# EasyEDA Pro project VOTV_Drive.eprj

# Schematic Schematic1

## Sheets
1 StepperDriver: Board Name: Board1; Create Date: 2025-09-23; Page Name: StepperDriver; Project Name: VOTV_Drive; Schematic Name: Schematic1; Update Date: 2025-09-26; Company: EasyEDA.com; Page Size: A4; Version: V1.0
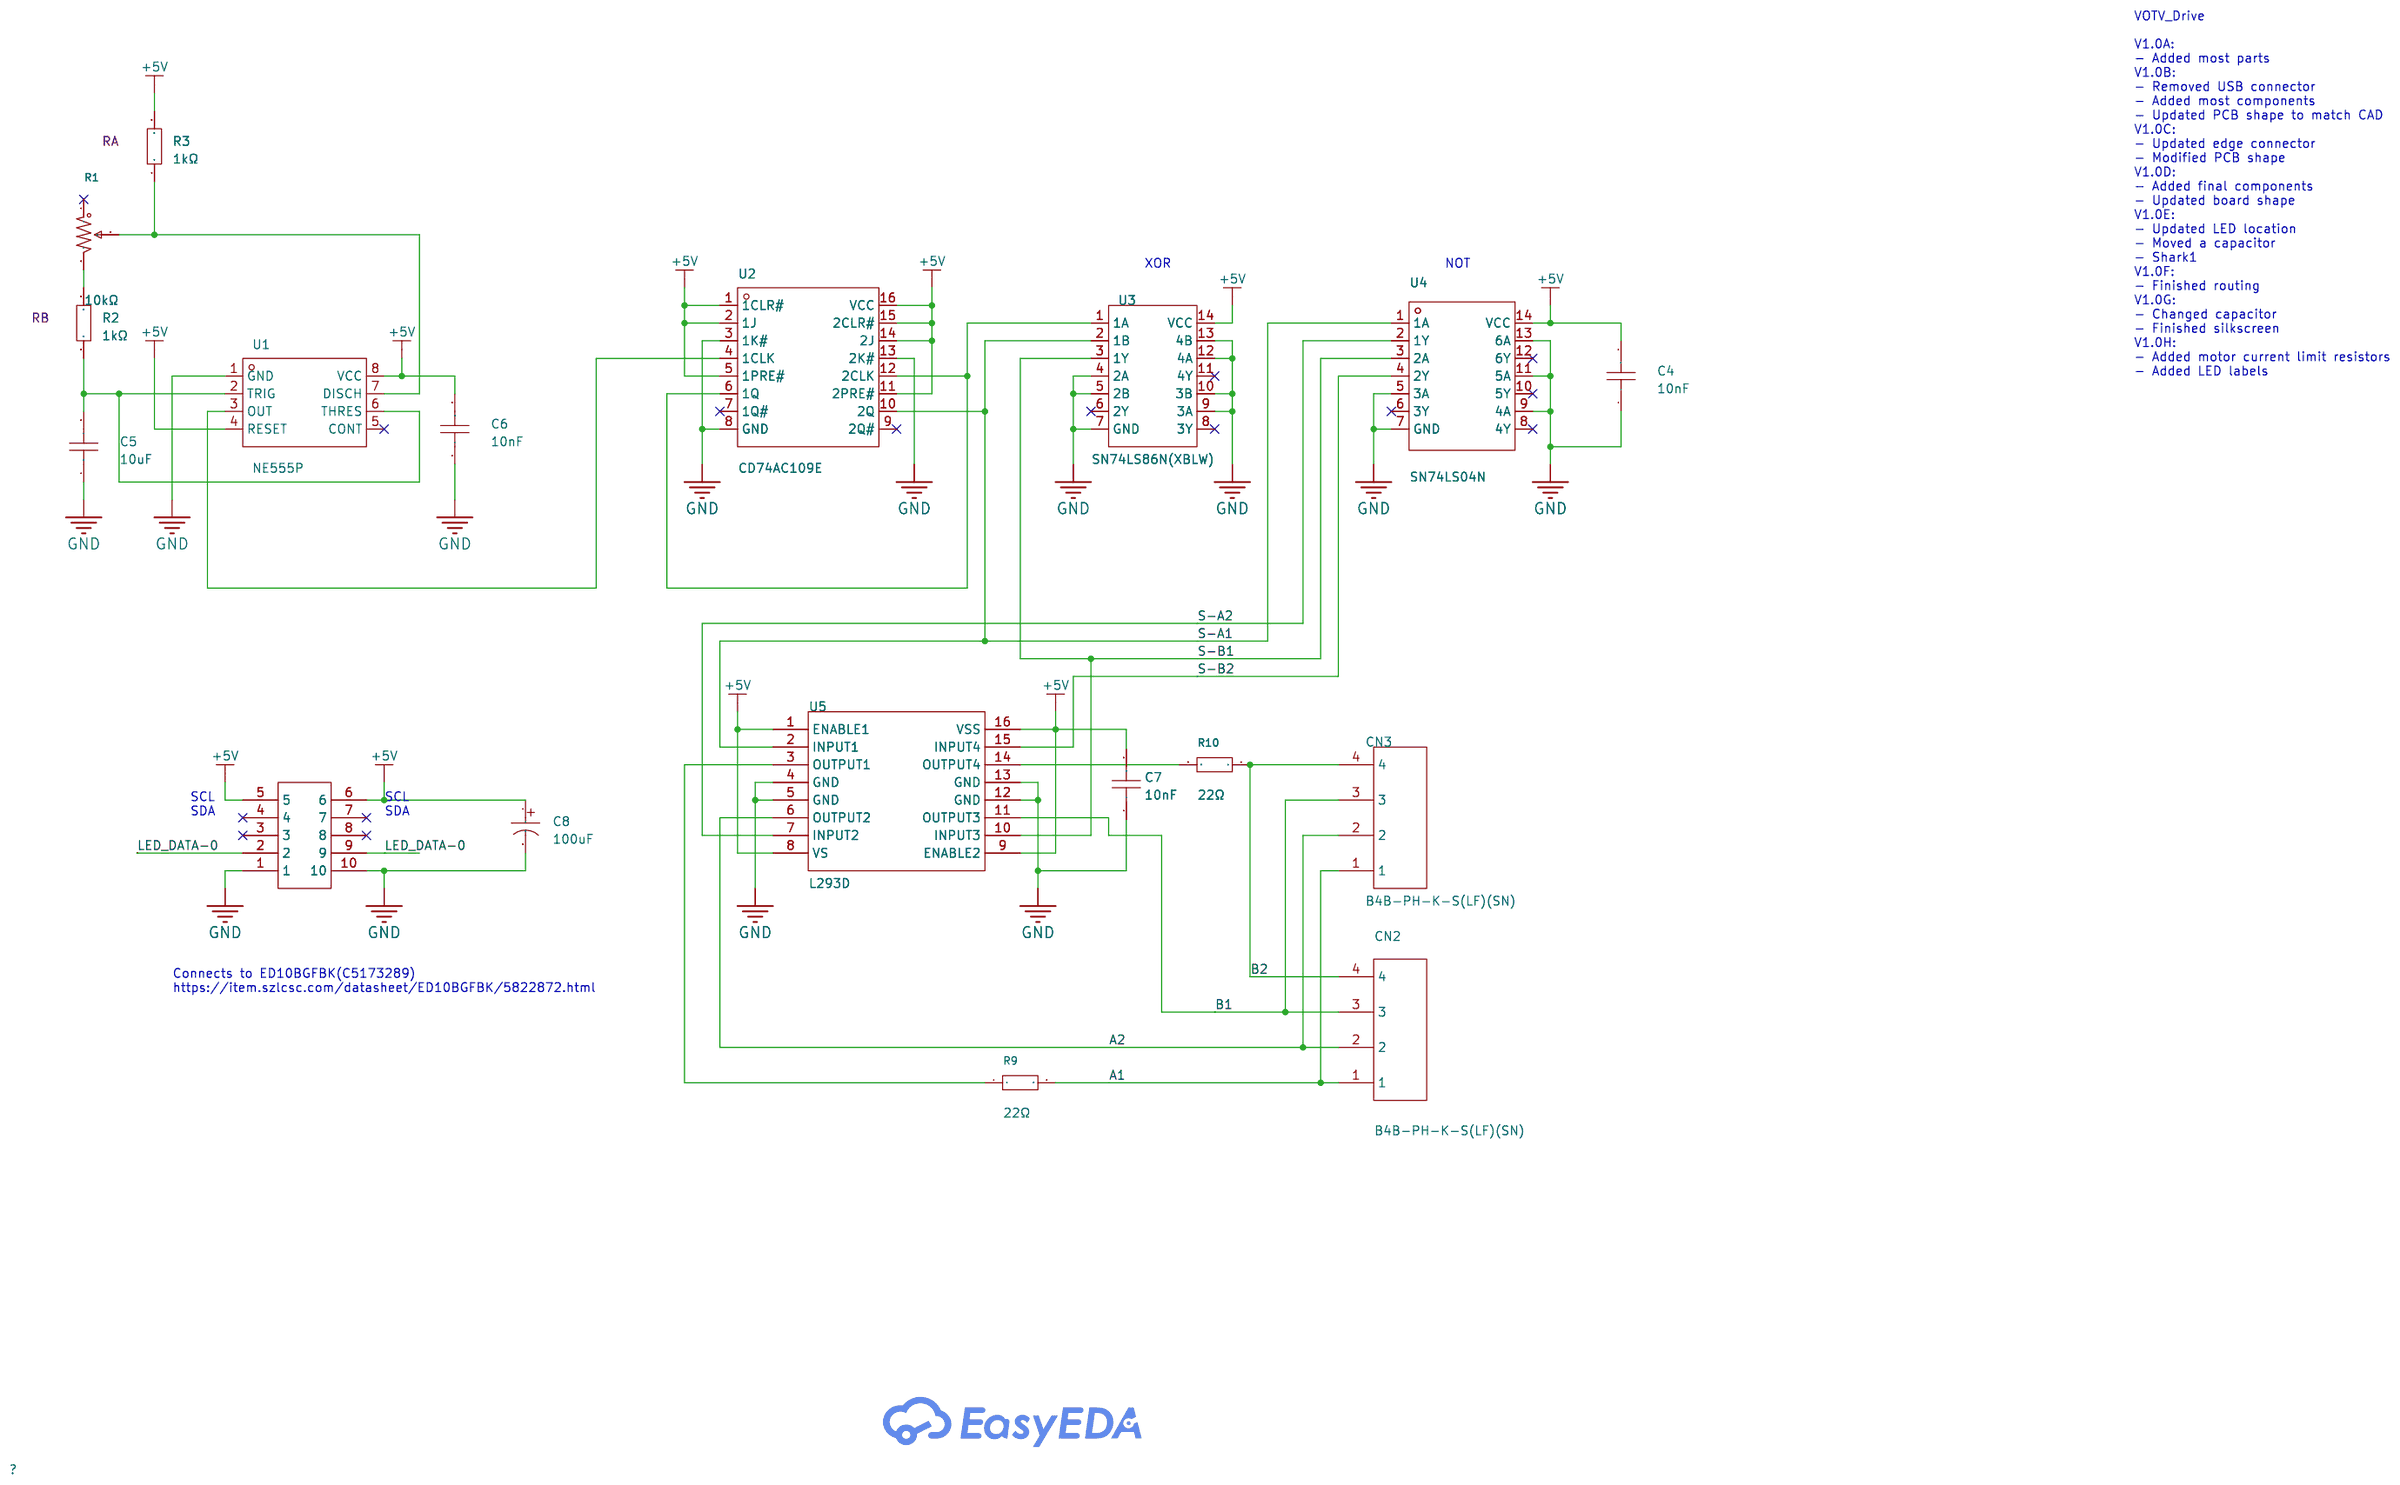
[diagram p0: StepperDriver]
2 Battery: Create Date: 2025-09-24; Page Name: Battery
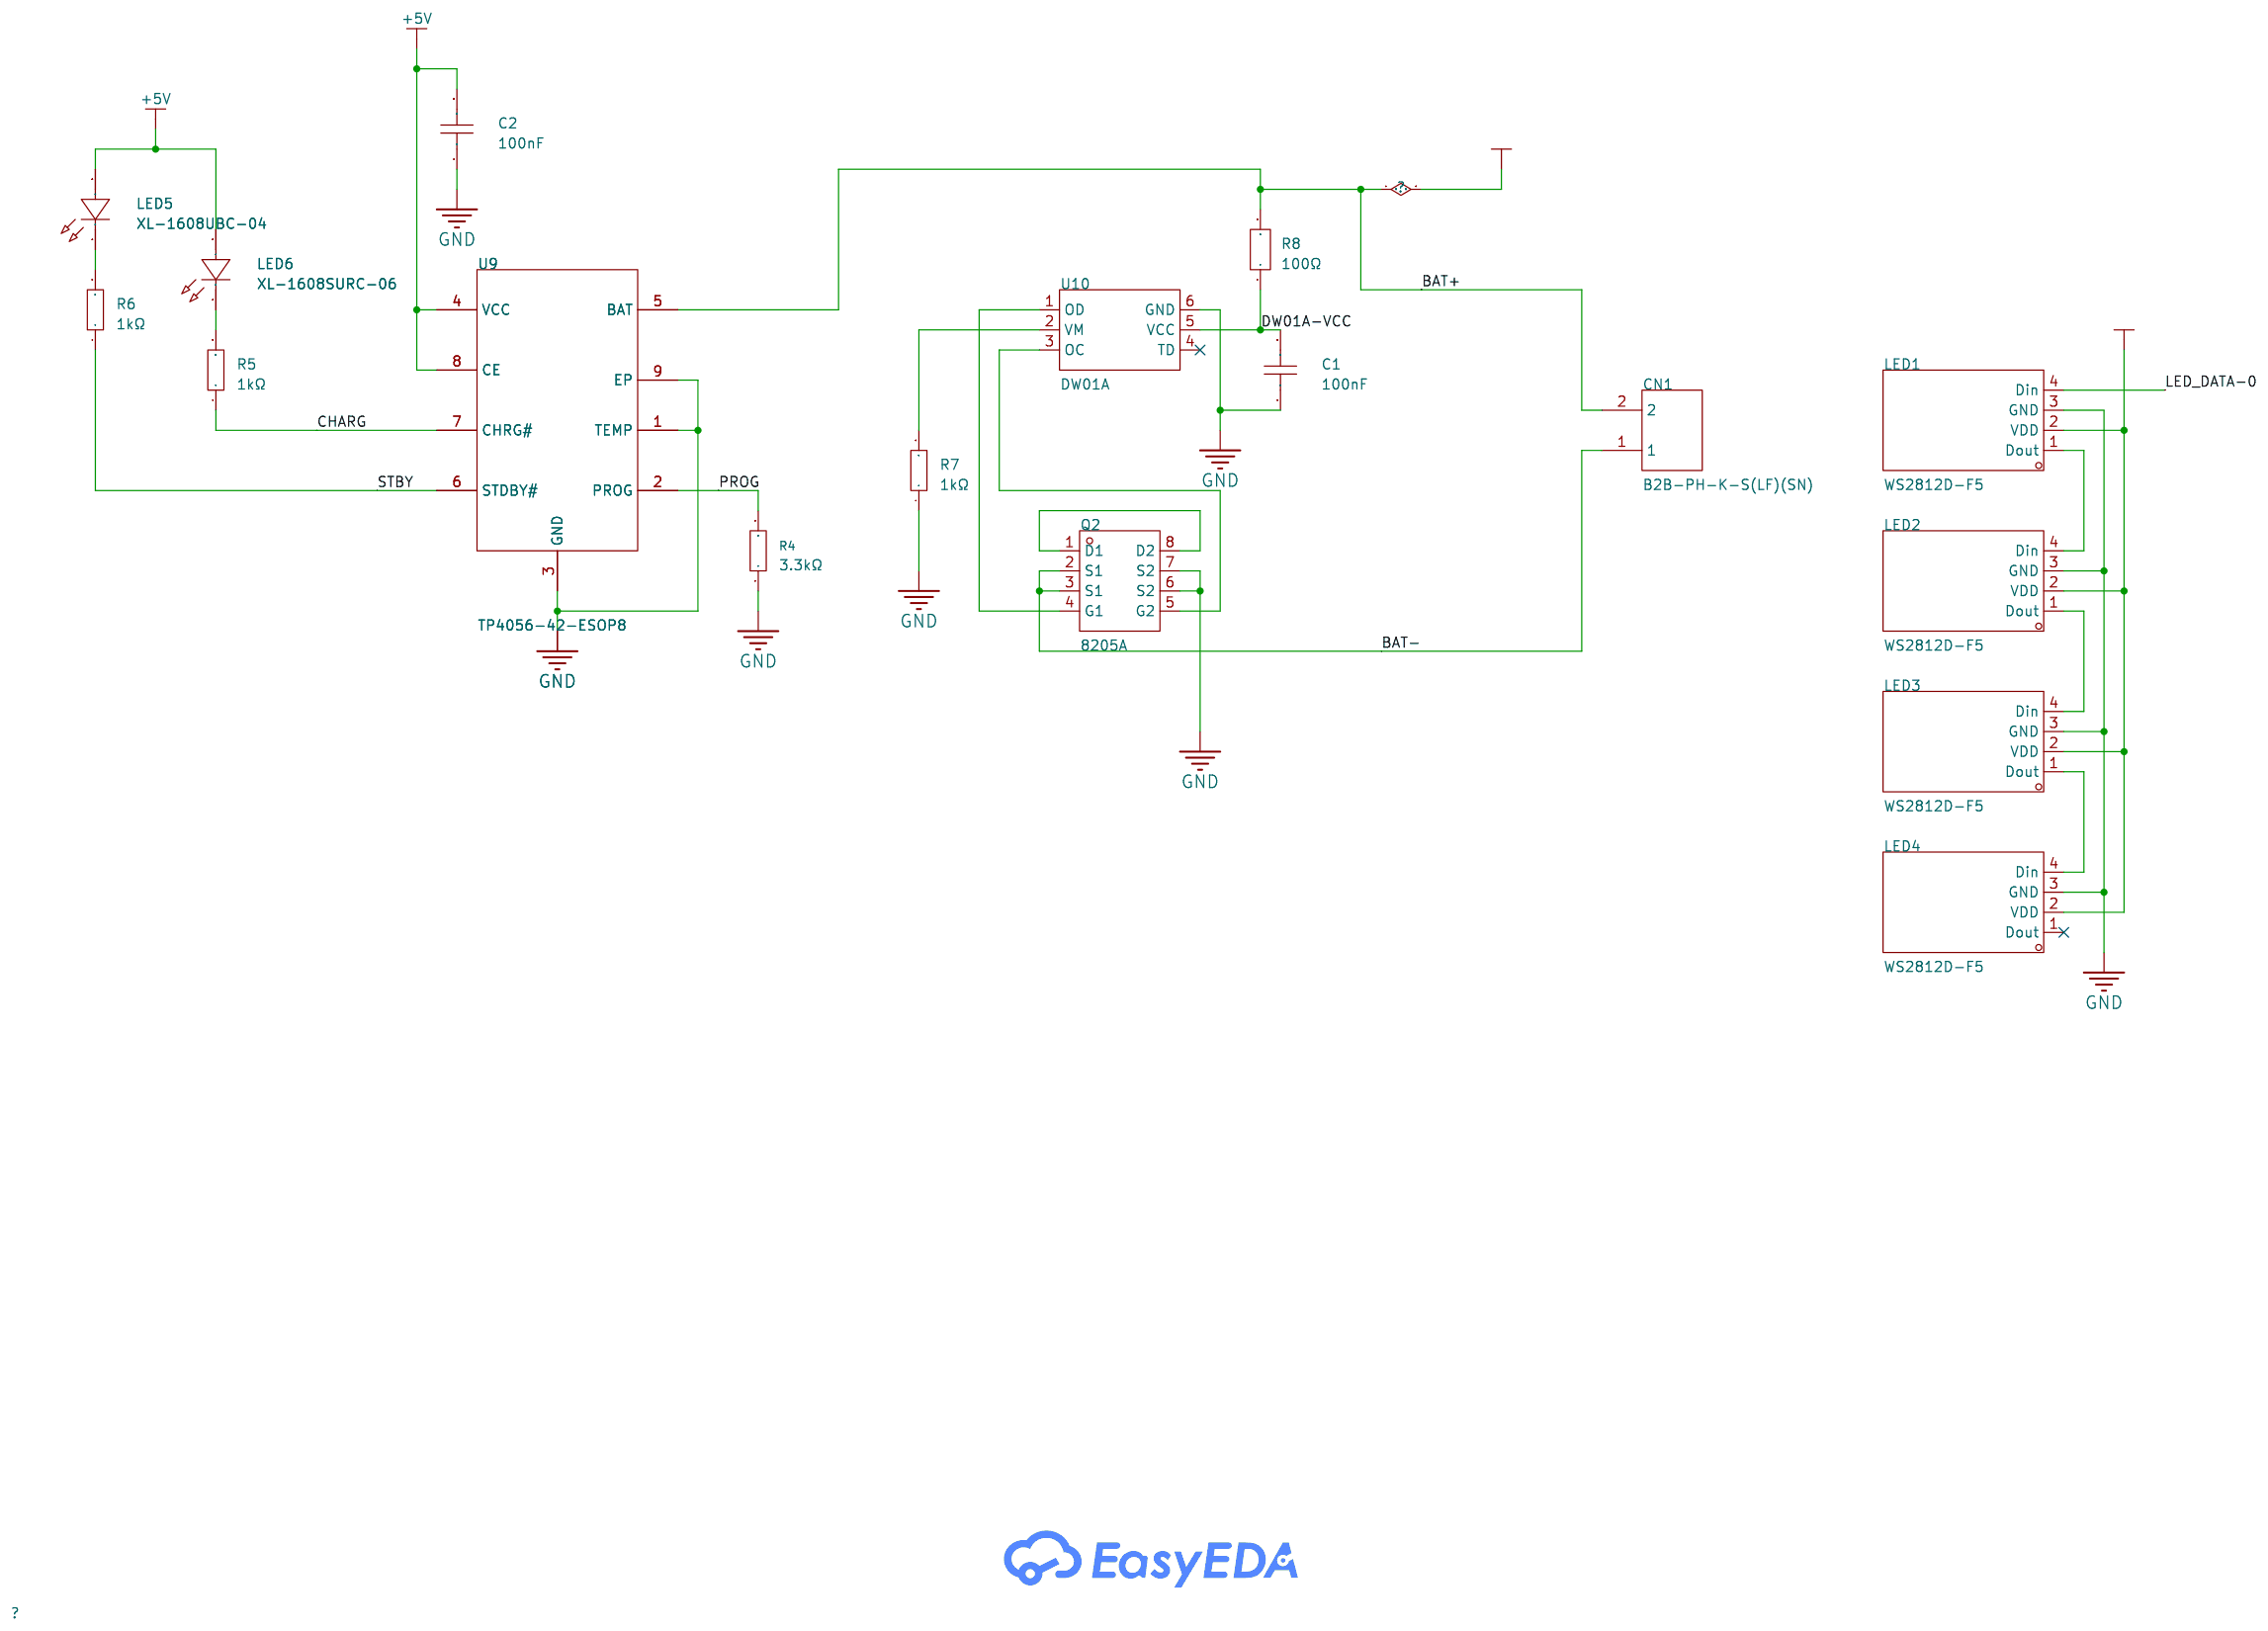
[diagram p1: Battery]

## Parts
sheet Battery
C1  100nF  [C0805]
C2  100nF  [C0805]
CN1  B2B-PH-K-S(LF)(SN)  [CONN-TH_B2B-PH-K-S]
LED1  WS2812D-F5  [LED-TH_4P-BD5.8-P1.30]
LED2  WS2812D-F5  [LED-TH_4P-BD5.8-P1.30]
LED3  WS2812D-F5  [LED-TH_4P-BD5.8-P1.30]
LED4  WS2812D-F5  [LED-TH_4P-BD5.8-P1.30]
LED5  XL-1608UBC-04  [LED0603-RD_BLUE]
LED6  XL-1608SURC-06  [LED0603-RD_RED]
Q2  8205A  [TSSOP-8_L4.4-W3.0-P0.65-LS6.4-BL]
R4  3.3kΩ  [R0603]
R5  1kΩ  [R0603]
R6  1kΩ  [R0603]
R7  1kΩ  [R0603]
R8  100Ω  [R0603]
U9  TP4056-42-ESOP8  [ESOP-8_L4.9-W3.9-P1.27-LS6.0-BL-EP]
U10  DW01A  [SOT-23-6_L2.9-W1.6-P0.95-LS2.8-BL]
sheet StepperDriver
C4  10nF  [CAP-TH_L5.5-W3.5-P5.00-D0.5]
C5  10uF  [CAP-TH_L5.5-W3.5-P5.00-D0.5]
C6  10nF  [CAP-TH_L5.5-W3.5-P5.00-D0.5]
C7  10nF  [CAP-TH_L5.5-W3.5-P5.00-D0.5]
C8  100uF  [CAP-TH_BD8.0-P3.50-D0.6-FD]
CN2  B4B-PH-K-S(LF)(SN)  [CONN-TH_B4B-PH-K-S]
CN3  B4B-PH-K-S(LF)(SN)  [CONN-TH_B4B-PH-K-S]
R1  10kΩ  [RES-ADJ-TH_WH06-2C-103]
R2  1kΩ  [RES-TH_BD1.8-L3.2-P7.20-D0.4]
R3  1kΩ  [RES-TH_BD1.8-L3.2-P7.20-D0.4]
R9  22Ω  [R0805]
R10  22Ω  [R0805]
U1  NE555P  [DIP-8_L9.8-W6.6-P2.54-LS7.6-BL]
U2  CD74AC109E  [PDIP-16_L19.1-W6.4-P2.54-LS7.62-BL]
U3  SN74LS86N(XBLW)  [DIP-14_L19.0-W6.4-P2.54-LS7.6-BL]
U4  SN74LS04N  [PDIP-14_L19.7-W6.6-P2.54-LS8.3-BL]
U5  L293D  [DIP-16_L20.0-W6.4-P2.54-LS7.6-BL]
U8  -  [EdgeConnector-10P-2.54mm	]

## Library data of the parts
C1 C2 = CC0805KRX7R9BB104: LCSC Part Name: 100nF ±10% 50V; Supplier Part: C49678; Manufacturer: YAGEO(国巨); Supplier Footprint: 0805; JLCPCB Part Class: Basic Part; Datasheet: https://item.szlcsc.com/datasheet/CC0805KRX7R9BB104/50686.html; Supplier: LCSC; Tolerance: ±10%; Voltage Rating: 50V; Temperature Coefficient: X7R
CN1 = B2B-PH-K-S(LF)(SN): LCSC Part Name: 1x2P 间距:2mm 直插 系列:PH; Supplier Part: C131337; Manufacturer: JST; Supplier Footprint: 插件,P=2mm; JLCPCB Part Class: Extended Part; Datasheet: https://atta.szlcsc.com/upload/public/pdf/source/20171026/C131342_15089839687311058815.pdf; Supplier: LCSC; Pins Structure: 1x2P; Pitch: 2mm; Mounting Type: Direct Insert; Reference Series: PH; Number of Pins: 2P; Number of Rows: 1; Number of PINs Per Row: 2; Current Rating: 2A; Contact Material: Brass; Contact Plating: Tin; Operating Temperature: -25℃~+85℃; Voltage Rating: 100V; Plastic Material: PA66; Flame Retardant Rating: UL94V-0; Supplementary Features: K-leg punch; Color: White; Z-Height of the Board: 6mm; X-Length of Bottom Edge on Board (Spacing Line): 5.9mm; Y-Width of Bottom Edge on Board: 4.5mm
LED1-LED4 = WS2812D-F5: LCSC Part Name: 智能控制通孔式LED集成光源; Supplier Part: C190565; Manufacturer: worldsemi; Supplier Footprint: 插件,D=5mm; JLCPCB Part Class: Extended Part; Datasheet: https://item.szlcsc.com/datasheet/WS2812D-F5/211094.html; Supplier: LCSC; Wavelength: R:620nm~625nm；B:465nm~470nm；G:520nm~525nm; Luminous Intensity: G:4000mcd；R:3000mcd；B:2500mcd; Fixed-Frequency Pwm Mode: 2kHz; Data Transmission Rate: 800Kbit/s; Voltage - Supply: 3.7V~5.3V; Operating Temperature: -25℃~+85℃; Peak Wavelength: G:522.5nm；R:622.5nm；B:467.5nm
LED5 = XL-1608UBC-04: LCSC Part Name: 0603蓝色贴片式发光二极管; Supplier Part: F; Manufacturer: XINGLIGHT(成兴光); Supplier Footprint: 0603; JLCPCB Part Class: Extended Part; Datasheet: https://item.szlcsc.com/datasheet/XL-1608UBC-04/1051416.html; Supplier: LCSC; Illumination Color: Blue; Voltage - Forward(Vf): 3.3V; Power(Watts): 70mW; Forward Current: 20mA; Wavelength - Dominant: 455nm~475nm; Peak Wavelength: 470nm; Lens Color: Water Clear; Luminous Intensity: 300mcd; Viewing Angle: 120°; Mounting Style: op View Mount
LED6 = XL-1608SURC-06: LCSC Part Name: 0603红色贴片式发光二极管; Supplier Part: C965799; Manufacturer: XINGLIGHT(成兴光); Supplier Footprint: 0603; JLCPCB Part Class: Extended Part; Datasheet: https://item.szlcsc.com/datasheet/XL-1608SURC-06/1051408.html; Supplier: LCSC; Illumination Color: Red; Voltage - Forward(Vf): 2.3V; Power(Watts): 50mW; Forward Current: 20mA; Wavelength - Dominant: 620nm~630nm; Peak Wavelength: 625nm; Lens Color: Water Clear; Luminous Intensity: 225mcd; Viewing Angle: 120°; Mounting Style: op View Mount; Operating Temperature: -40℃~+85℃
Q2 = 8205A_C5148694: LCSC Part Name: 双N沟道,电流:6A,耐压:20V; Supplier Part: C5148694; Manufacturer: HXY MOSFET(华轩阳电子); Supplier Footprint: TSSOP-8; JLCPCB Part Class: Extended Part; Datasheet: https://item.szlcsc.com/datasheet/8205A/5771942.html; Supplier: LCSC; Number: 2 N-Channel; Drain to Source Voltage: 20V; Current - Continuous Drain(Id): 6A; RDS(on): 37mΩ@2.5V,3.5A; Pd - Power Dissipation: 1.5W; Gate Threshold Voltage (Vgs(th)): 500mV; Gate Charge(Qg): 15nC@4.5V; Input Capacitance(Ciss): 600pF; Reverse Transfer Capacitance (Crss@Vds): 140pF; Operating Temperature: -55℃~+150℃
R4 = 0603WAF3301T5E: LCSC Part Name: 3.3kΩ ±1% 100mW 厚膜电阻; Supplier Part: C22978; Manufacturer: UNI-ROYAL(厚声); Supplier Footprint: 0603; JLCPCB Part Class: Basic Part; Datasheet: https://item.szlcsc.com/datasheet/0603WAF3301T5E/23705.html; Supplier: LCSC; Type: Thick Film Resistor; Tolerance: ±1%; Power(Watts): 100mW; Voltage-Supply(Max): 75V; Temperature Coefficient: ±100ppm/℃; Operating Temperature: -55℃~+155℃
R5-R7 = 0603WAF1001T5E: LCSC Part Name: 1kΩ ±1% 100mW 厚膜电阻; Supplier Part: C21190; Manufacturer: UNI-ROYAL(厚声); Supplier Footprint: 0603; JLCPCB Part Class: Basic Part; Datasheet: https://atta.szlcsc.com/upload/public/pdf/source/20200306/C422600_1E6D84923E4A46A82E41ADD87F860B5C.pdf; Supplier: LCSC; Type: Thick Film Resistors; Tolerance: ±1%; Temperature Coefficient: ±100ppm/℃; Operating Temperature Range: -55℃~+155℃
R8 = FRC0603J101 TS: LCSC Part Name: 100Ω ±5% 100mW 厚膜电阻; Supplier Part: C2907089; Manufacturer: FOJAN(富捷); Supplier Footprint: 0603; JLCPCB Part Class: Extended Part; Supplier: LCSC; Type: Thick Film Resistor; Tolerance: ±5%; Power(Watts): 100mW; Voltage-Supply(Max): 75V; Temperature Coefficient: ±100ppm/℃; Operating Temperature: -55℃~+155℃
U9 = TP4056-42-ESOP8: LCSC Part Name: 单节锂离子电池线性充电器; Supplier Part: C16581; Manufacturer: TOPPOWER(南京拓微); Supplier Footprint: ESOP-8; JLCPCB Part Class: Extended Part; Datasheet: https://item.szlcsc.com/datasheet/TP4056-42-ESOP8/17264.html; Supplier: LCSC; The Chip Type: Linear Charging IC; Voltage - Supply: 4V~8V; Charge Current - Max: 1A; Charging Saturation Voltage: 4.2V; Type of Battery: Lithium-ion/Polymer; Number of Cells: 1; Operating Temperature: -40℃~+85℃
U10 = DW01A_C351410: Supplier Part: C351410; Manufacturer: PUOLOP(迪浦); Supplier Footprint: SOT-23-6L; JLCPCB Part Class: Extended Part; Datasheet: https://atta.szlcsc.com/upload/public/pdf/source/20190109/C351410_3E9B9491D1909DF24C48D1B9CD871392.pdf; Supplier: LCSC
C4-C7 = FG26X7R1E106KRT06: LCSC Part Name: 10uF ±10% 25V; Supplier Part: C531341; Manufacturer: TDK; Supplier Footprint: 插件,P=5mm; JLCPCB Part Class: Extended Part; Datasheet: https://item.szlcsc.com/datasheet/FG26X7R1E106KRT06/551502.html; Supplier: LCSC; Tolerance: ±10%; Voltage Rating: 25V; Temperature Coefficient: X7R
C8 = KM107M050F12RR0VH2FP0: LCSC Part Name: 100uF ±20% 50V; Supplier Part: C2749; Manufacturer: Chengx(承兴); Supplier Footprint: 插件,D8xL12mm; JLCPCB Part Class: Extended Part; Datasheet: https://item.szlcsc.com/datasheet/KM107M050F12RR0VH2FP0/3130.html; Supplier: LCSC; Tolerance: ±20%; Voltage Rating: 50V; Pin Spacing: 3.5mm; Diameter: 8mm; Height - Seated (Max): 12mm; Lifetime: 2000hrs@105℃
CN2 CN3 = B4B-PH-K-S(LF)(SN)_C131334: LCSC Part Name: 1x4P 间距:2mm 直插 系列:PH; Supplier Part: C131334; Manufacturer: JST; Supplier Footprint: 插件,P=2mm; JLCPCB Part Class: Extended Part; Datasheet: https://item.szlcsc.com/datasheet/B4B-PH-K-S(LF)(SN)/142627.html; Supplier: LCSC; Pins Structure: 1x4P; Pitch: 2mm; Mounting Type: Through Hole; Reference Series: PH; Number of Pins: 4P; Number of Rows: 1; Number of PINs Per Row: 4; Current Rating: 2A; Contact Material: Brass; Contact Plating: Tin; Operating Temperature: -25℃~+85℃; Voltage Rating: 100V; Plastic Material: PA66; Flame Retardant Rating: UL94V-0; Supplementary Features: K Pin; Color: White; Z-Height of the Board: 6mm; X-Length of Bottom Edge on Board (Spacing Line): 9.9mm; Y-Width of Bottom Edge on Board: 4.5mm
R1 = WH06-2C-103(10K): LCSC Part Name: 10kΩ ±25%; Supplier Part: C5205043; Manufacturer: BOCHEN(博晨); Supplier Footprint: 插件; JLCPCB Part Class: Extended Part; Datasheet: https://atta.szlcsc.com/upload/public/pdf/source/20221019/683A1EE763180882FA5E0C1228474CEE.pdf; Supplier: LCSC; Tolerance: ±25%
R2 = Res_AXIAL-1/8W: Supplier Footprint: Through; Comment: RB
R3 = Res_AXIAL-1/8W: Supplier Footprint: Through; Comment: RA
R9 R10 = 0805W8F220JT5E: LCSC Part Name: 22Ω ±1% 125mW 厚膜电阻; Supplier Part: C17561; Manufacturer: UNI-ROYAL(厚声); Supplier Footprint: 0805; JLCPCB Part Class: Basic Part; Datasheet: https://item.szlcsc.com/datasheet/0805W8F220JT5E/18249.html; Supplier: LCSC; Type: Thick Film Resistor; Tolerance: ±1%; Power(Watts): 125mW; Voltage-Supply(Max): 150V; Temperature Coefficient: ±100ppm/℃; Operating Temperature: -55℃~+155℃
U1 = NE555P: Supplier Part: C46749; Manufacturer: TI(德州仪器); Supplier Footprint: DIP-8; JLCPCB Part Class: Extended Part; Datasheet: https://www.ti.com/cn/lit/gpn/ne555; Supplier: LCSC
U2 = CD74AC109E: Supplier Part: C1549858; Manufacturer: TI(德州仪器); Supplier Footprint: PDIP-16; JLCPCB Part Class: Extended Part; Datasheet: https://www.ti.com/cn/lit/gpn/cd54ac109; Supplier: LCSC; Type: JK-Type; Trigger Type: Rising Edge; Voltage - Supply: 1.5V~5.5V; Clock Frequency: 100MHz; Function: Set and Reset; Number of Elements: 2; Number of Bits per Element: 1; Output Type: Complementary Type; Propagation Delay: 10.3ns@5V,50pF; Series: 74ACSeries; Current - Output Low(IOL): 24mA; Current - Output High(IOH): 24mA; Quiescent Current: 4uA; Input Capacitance: 10pF; Operating Temperature: -55℃~+125℃
U3 = SN74LS86N(XBLW): Supplier Part: C42415784; Manufacturer: XBLW(芯伯乐); Supplier Footprint: DIP-14; JLCPCB Part Class: Extended Part; Datasheet: https://item.szlcsc.com/datasheet/SN74LS86N(XBLW)/44412904.html; Supplier: LCSC; Logic Type: XOR Gate; Number of Channels: 4; Voltage - Supply: 2V~6V; Quiescent Current: 2uA; Current - Output Low(IOL): 5.2mA; Current - Output High(IOH): 5.2mA; Input Logic Level - High: 1.2V~3.2V; Input Logic Level - Low: 800mV~2.8V; Output Logic Level - High: 2V~5.81V
U4 = SN74LS04N: Supplier Part: C183657; Manufacturer: TI(德州仪器); Supplier Footprint: PDIP-14; JLCPCB Part Class: Extended Part; Datasheet: https://www.ti.com/cn/lit/gpn/sn74ls04; Supplier: LCSC; Voltage - Supply: 4.75V~5.25V; Number of Circuits: 6; Number of Inputs: 1; Current - Output Low(IOL): 8mA; Current - Output High(IOH): 400uA; Input Logic Level - High: 2V; Input Logic Level -Low: 800mV; Max Propagation Delay: 15ns@5V,15pF; Series: 74LSSeries; Operating Temperature: 0℃~+70℃
U5 = L293D_C12340: LCSC Part Name: 600mA 有刷直流电机驱动芯片 36V; Supplier Part: C12340; Manufacturer: ST(意法半导体); Supplier Footprint: DIP-16; JLCPCB Part Class: Extended Part; Datasheet: https://atta.szlcsc.com/upload/public/pdf/source/20140724/1457707157802.pdf; Supplier: LCSC
U8 = EdgeConnector-10P-2.54mm

## Nets
+5V: C2.2 C4.2 C6.2 C7.2 C8.1 LED5.2(A) LED6.2(A) R3.2 U1.4(RESET) U1.8(VCC) U2.1(1CLR#) U2.2(1J) U2.5(1PRE#) U2.11(2PRE#) U2.14(2J) U2.15(2CLR#) U2.16(VCC) U3.14(VCC) U4.14(VCC) U5.1(ENABLE1) U5.8(VS) U5.9(ENABLE2) U5.16(VSS) U8.5 U8.6 U9.4(VCC) U9.8(CE)
GND: C1.1 C2.1 C4.1 C5.1 C6.1 C7.1 C8.2 LED1.3(GND) LED2.3(GND) LED3.3(GND) LED4.3(GND) Q2.6(S2) Q2.7(S2) R4.1 R7.1 U1.1(GND) U2.3(1K#) U2.8(GND) U2.13(2K#) U3.4(2A) U3.5(2B) U3.7(GND) U3.9(3A) U3.10(3B) U3.12(4A) U3.13(4B) U4.5(3A) U4.7(GND) U4.9(4A) U4.11(5A) U4.13(6A) U5.4(GND) U5.5(GND) U5.12(GND) U5.13(GND) U8.1 U8.10 U9.1(TEMP) U9.3(GND) U9.9(EP) U10.6(GND)
A1: CN2.1 CN3.1 R9.2
A2: CN2.2 CN3.2 U5.6(OUTPUT2)
B1: CN2.3 CN3.3 U5.11(OUTPUT3)
B2: CN2.4 CN3.4 R10.1
BAT-: CN1.1 Q2.2(S1) Q2.3(S1)
BAT_VOUT: CN1.2 LED1.2(VDD) LED2.2(VDD) LED3.2(VDD) LED4.2(VDD) R8.2 U9.5(BAT)
CHARG: R5.1 U9.7(CHRG#)
DW01A-VCC: C1.2 R8.1 U10.5(VCC)
LED_DATA-0: LED1.4(Din) U8.2 U8.9
PROG: R4.2 U9.2(PROG)
S-A1: U2.10(2Q) U3.2(1B) U4.1(1A) U5.2(INPUT1)
S-A2: U4.2(1Y) U5.7(INPUT2)
S-B1: U3.3(1Y) U4.3(2A) U5.10(INPUT3)
S-B2: U4.4(2Y) U5.15(INPUT4)
STBY: R6.1 U9.6(STDBY#)
$1N1551: C5.2 R2.1 U1.2(TRIG) U1.6(THRES)
$1N1658: R1.3 R3.1 U1.7(DISCH)
$1N1662: R1.2 R2.2
$1N1856: U1.3(OUT) U2.4(1CLK)
$1N1934: U2.6(1Q) U2.12(2CLK) U3.1(1A)
$1N10913: R9.1 U5.3(OUTPUT1)
$1N11045: R10.2 U5.14(OUTPUT4)
$2N372: Q2.5(G2) U10.3(OC)
$2N386: R7.2 U10.2(VM)
$2N1182: LED1.1(Dout) LED2.4(Din)
$2N1186: LED2.1(Dout) LED3.4(Din)
$2N1199: LED3.1(Dout) LED4.4(Din)
$2N2605: LED5.1(K) R6.2
$2N2609: LED6.1(K) R5.2
$2N3306: Q2.1(D1) Q2.8(D2)
$2N3476: Q2.4(G1) U10.1(OD)

Not connected (* = marked no-connect by the designer): LED4 1(Dout)*; R1 1*; U1 5(CONT)*; U2 7(1Q#)* 9(2Q#)*; U3 6(2Y)* 8(3Y)* 11(4Y)*; U4 6(3Y)* 8(4Y)* 10(5Y)* 12(6Y)*; U8 3* 4* 7* 8*; U10 4(TD)*

## Notes on the sheets
sheet 1
- VOTV_Drive
- V1.0A:
  - Added most parts
  V1.0B:
  - Removed USB connector
  - Added most components
  - Updated PCB shape to match CAD
  V1.0C:
  - Updated edge connector
  - Modified PCB shape
  V1.0D:
  - Added final components
  - Updated board shape
  V1.0E:
  - Updated LED location
  - Moved a capacitor
  - Shark1
  V1.0F:
  - Finished routing
  V1.0G:
  - Changed capacitor
  - Finished silkscreen
  V1.0H:
  - Added motor current limit resistors
  - Added LED labels
- XOR
- NOT
- SCL
  SDA
- SCL
  SDA
- Connects to ED10BGFBK(C5173289)
  https://item.szlcsc.com/datasheet/ED10BGFBK/5822872.html

# Board PCB1
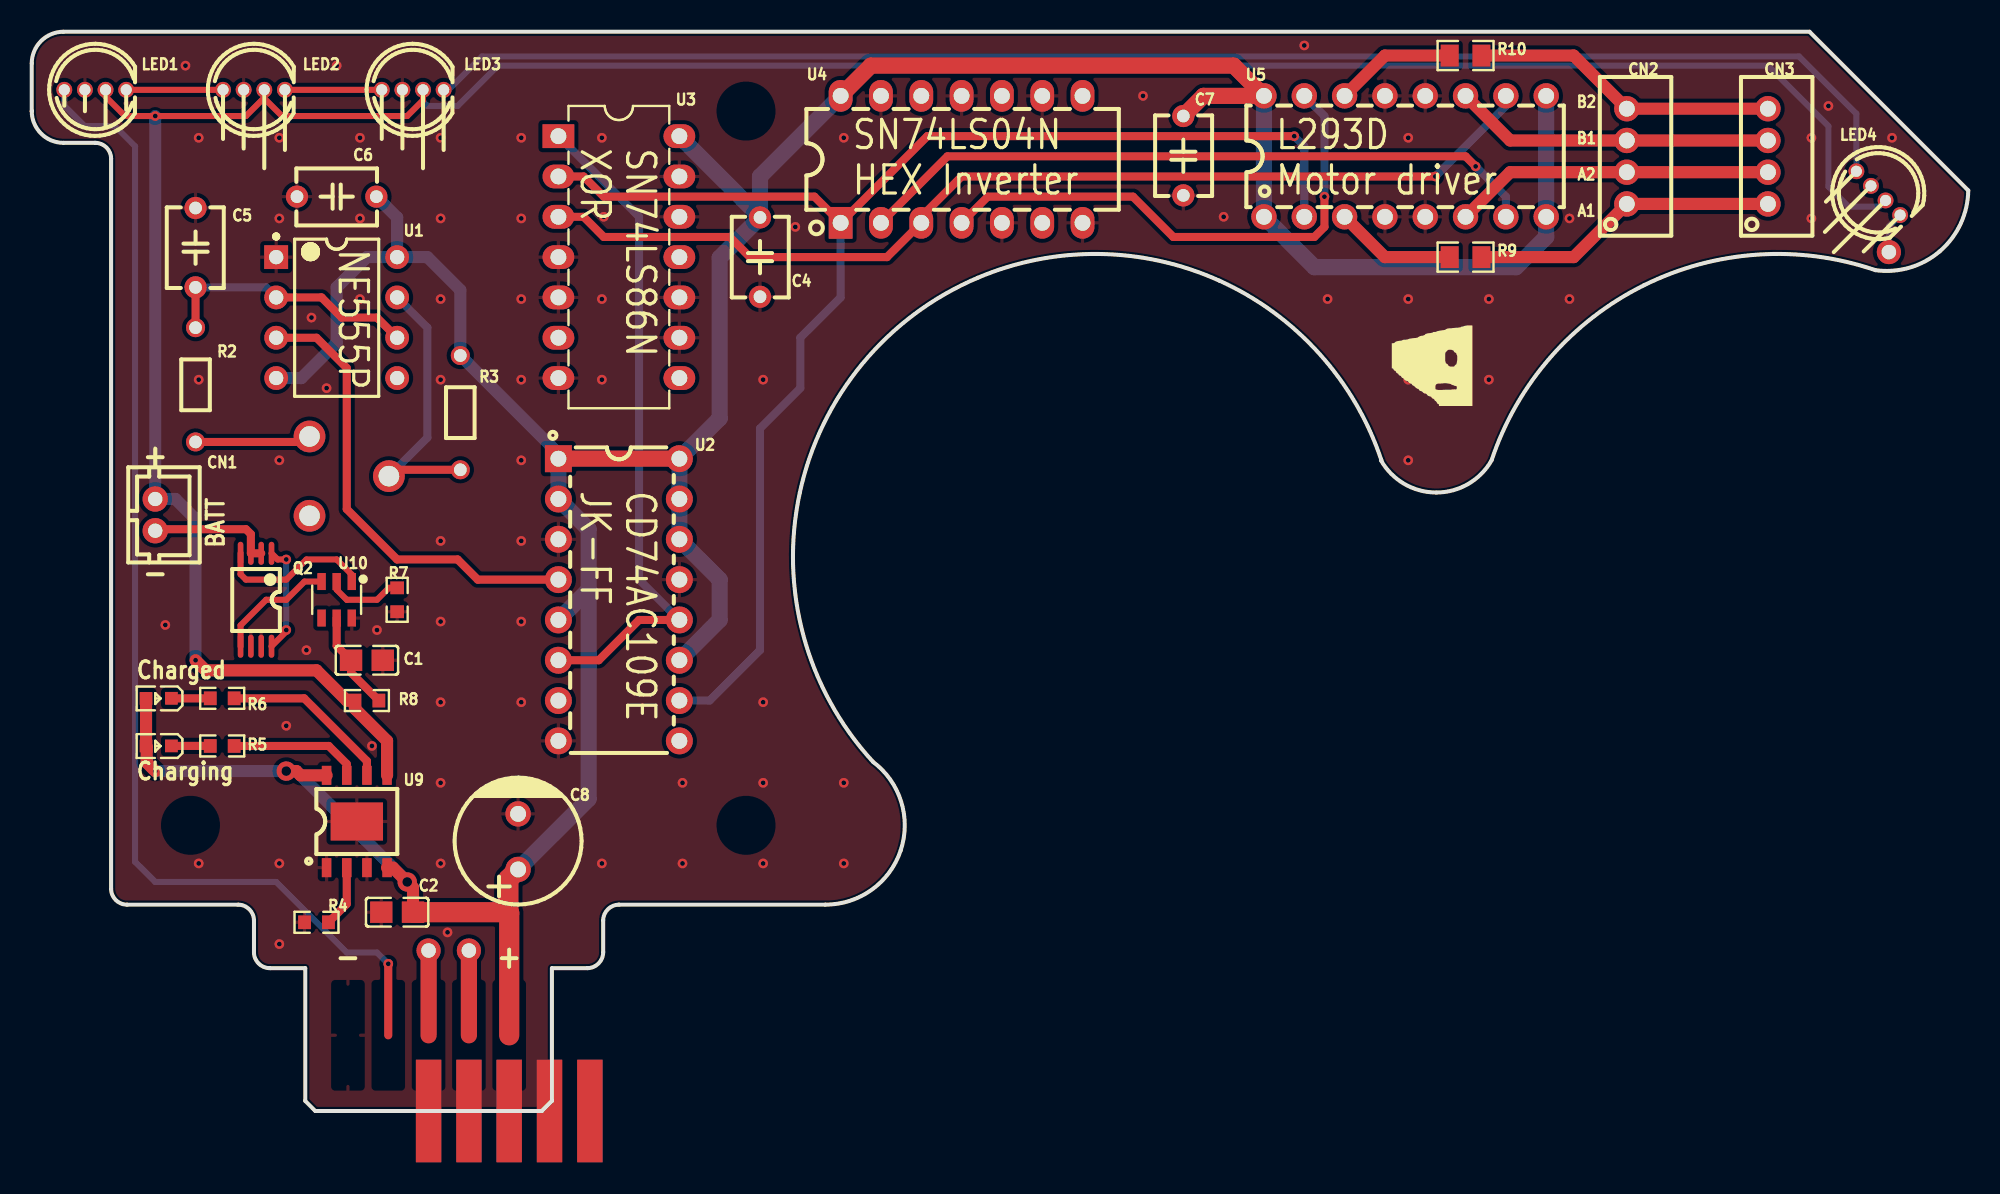
[diagram p2: board, top side]
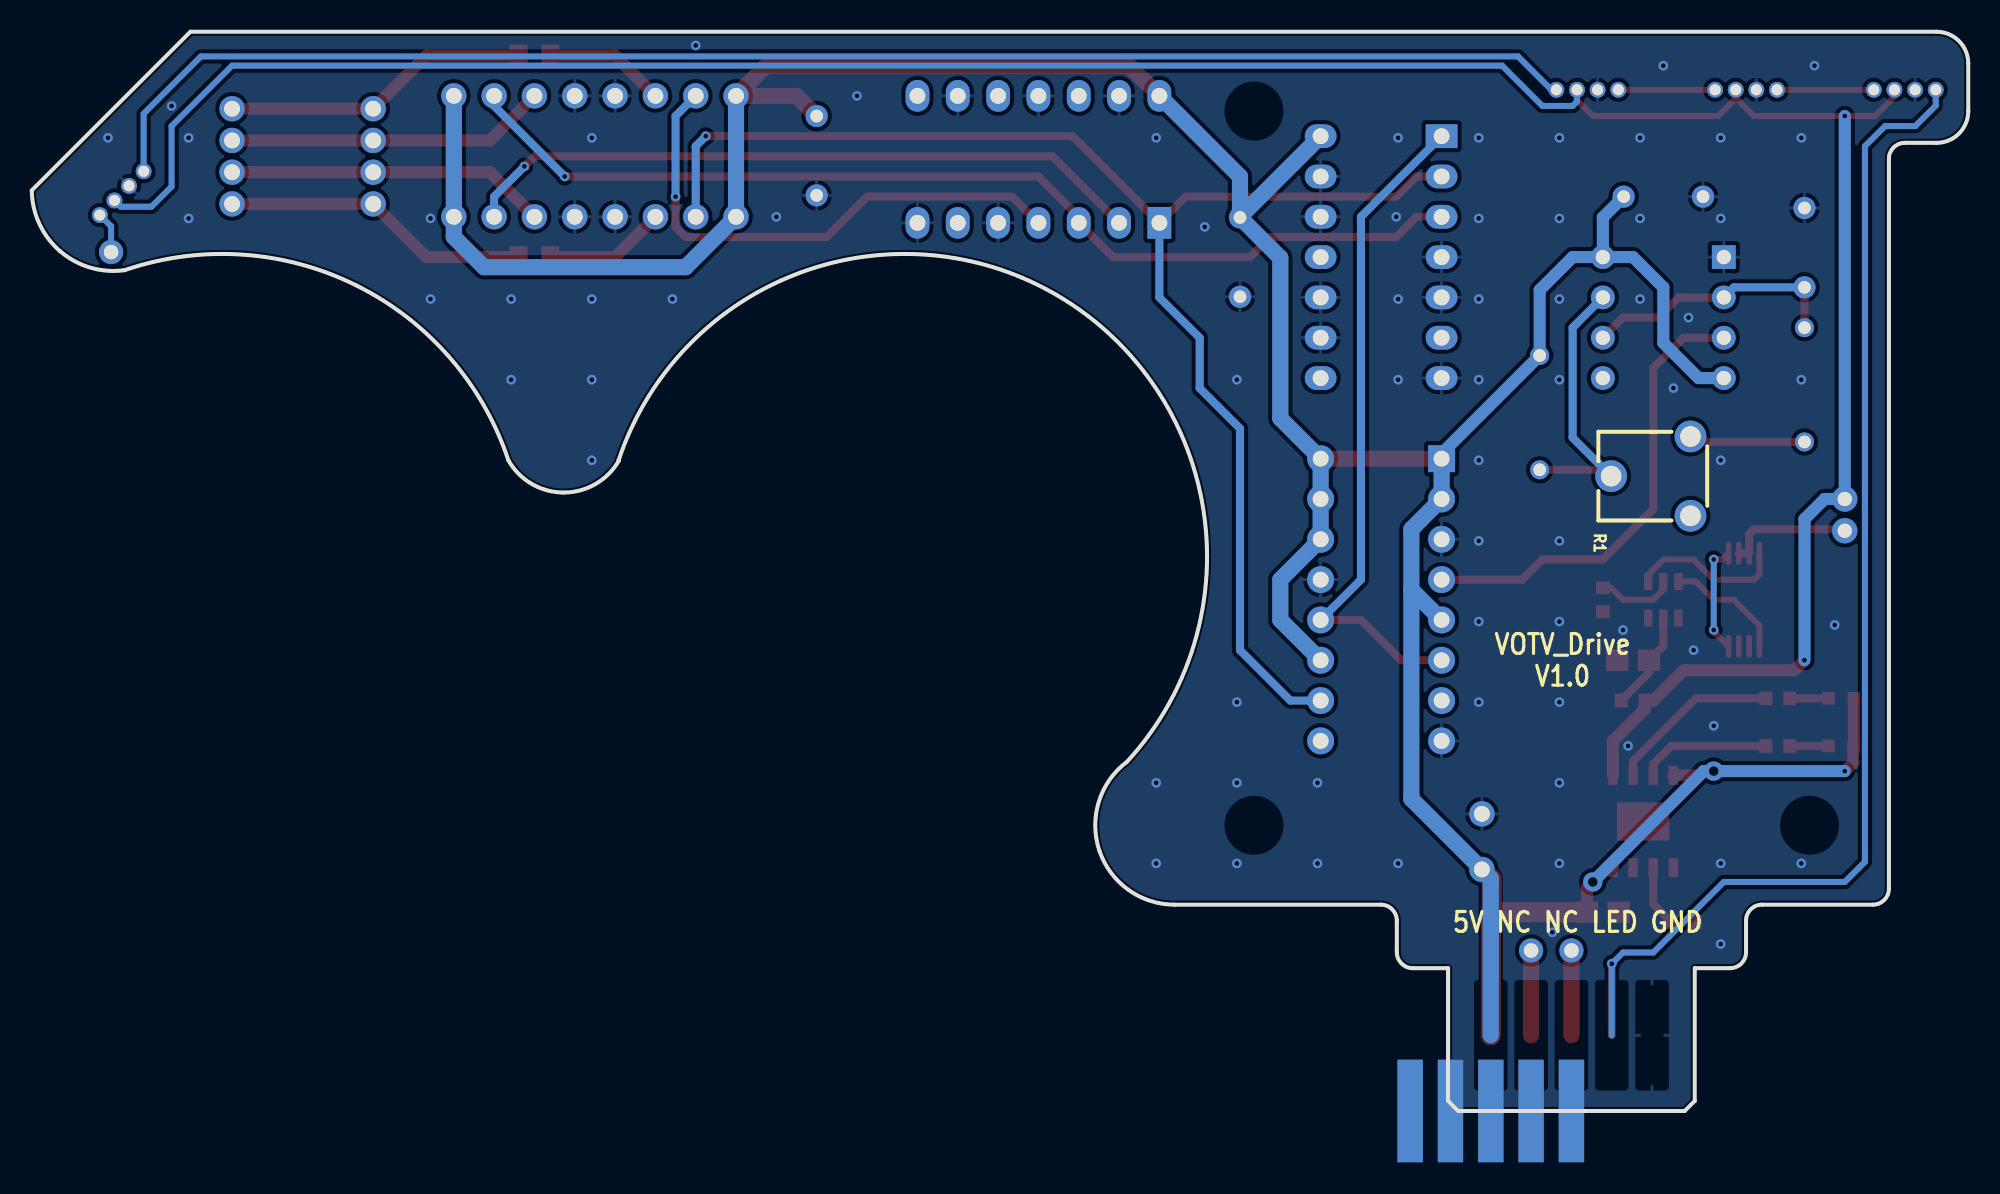
[diagram p3: board, bottom side, seen from below]

Outline 122 x 68 mm; copper layers: Top Layer, Bottom Layer. Coordinates in mm from the lower left corner of the outline.
Outline path: 0,66 arc(0.59,67.41) 2,68 112,68 122,58 arc(121.52,55.89) 120.21,54.17 arc(118.31,53.14) 116.15,52.98 arc(108.76,53.96) 101.57,52.03 arc(95.67,47.47) 91.97,41 arc(90.5,39.51) 88.49,38.97 arc(86.47,39.51) 85,41 85.03,41 arc(81.11,47.72) 74.83,52.31 arc(67.23,54) 59.59,52.5 arc(52.34,47.09) 48.39,38.96 arc(48.63,29.92) 53,22 arc(54.77,19.49) 54.74,16.42 arc(52.92,13.94) 50,13 37,13 arc(36.29,12.71) 36,12 36,10 arc(35.71,9.29) 35,9 32.77,9 32.77,0.63 32.13,0 17.86,0 17.23,0.63 17.23,9 15,9 arc(14.29,9.29) 14,10 14,12 arc(13.71,12.71) 13,13 6,13 arc(5.29,13.29) 5,14 5,60 arc(4.71,60.71) 4,61 2,61 arc(0.59,61.59) 0,63 0,63 0,66
Stack: Top Layer 0.035mm / Dielectric1 1.51mm FR4 er 4.5 / Bottom Layer 0.035mm

## Design rules (mm)
template: JLCPCB Capability(Two Layers Board)
spacing copperThickness1oz (default): track to track 0.102, other pairs 0.152 to 0.3
spacing copperThickness2oz: track to track 0.203, other pairs 0.152 to 0.3
track width copperThickness1oz (default): min 0.127, default 0.254, max 2.54
track width copperThickness2oz: min 0.203, default 0.254, max 2.54
differential pair differentialPair (default): width min 0.127, default 0.254, max 2.54; gap min 0.152, default 0.152
via viaSize (default): diameter min 0.5, default 0.61, max 10; hole min 0.3, default 0.305, max 6.3

## Placement (name value [footprint] x y rotation side)
C1  100nF  [C0805]  21.11 28.4 180 top
C2  100nF  [C0805]  23.02 12.52 0 top
C4  10nF  [CAP-TH_L5.5-W3.5-P5.00-D0.5]  45.88 53.8 90 top
C5  10uF  [CAP-TH_L5.5-W3.5-P5.00-D0.5]  10.32 54.39 270 top
C6  10nF  [CAP-TH_L5.5-W3.5-P5.00-D0.5]  19.21 57.61 0 top
C7  10nF  [CAP-TH_L5.5-W3.5-P5.00-D0.5]  72.55 60.19 90 top
C8  100uF  [CAP-TH_BD8.0-P3.50-D0.6-FD]  30.64 16.97 90 top
CN1  B2B-PH-K-S(LF)(SN)  [CONN-TH_B2B-PH-K-S]  7.78 37.56 270 top
CN2  B4B-PH-K-S(LF)(SN)  [CONN-TH_B4B-PH-K-S]  100.49 60.15 270 top
CN3  B4B-PH-K-S(LF)(SN)  [CONN-TH_B4B-PH-K-S]  109.38 60.15 270 top
LED1  WS2812D-F5  [LED-TH_4P-BD5.8-P1.30]  4 64.34 0 top
LED2  WS2812D-F5  [LED-TH_4P-BD5.8-P1.30]  14 64.34 0 top
LED3  WS2812D-F5  [LED-TH_4P-BD5.8-P1.30]  24 64.34 0 top
LED4  WS2812D-F5  [LED-TH_4P-BD5.8-P1.30#2]  116.33 57.83 315 top
LED5  XL-1608UBC-04  [LED0603-RD_BLUE]  8 26 180 top
LED6  XL-1608SURC-06  [LED0603-RD_RED]  8 23 180 top
NOREF  -  [Pad_e3454]  117 54.12 0 top
NOREF#2  -  [Pad_e3190]  25 10.11 0 top
NOREF#3  -  [Pad_e3447]  27.54 10.11 0 top
Q2  8205A  [TSSOP-8_L4.4-W3.0-P0.65-LS6.4-BL]  14.13 32.21 180 top
R1  10kΩ  [RES-ADJ-TH_WH06-2C-103]  20 40 90 bottom
R2  1kΩ  [RES-TH_BD1.8-L3.2-P7.20-D0.4]  10.32 45.75 270 top
R3  1kΩ  [RES-TH_BD1.8-L3.2-P7.20-D0.4]  27 44 90 top
R4  3.3kΩ  [R0603]  17.94 11.89 0 top
R5  1kΩ  [R0603]  12 23 180 top
R6  1kΩ  [R0603]  12 26 180 top
R7  1kΩ  [R0603]  23.02 32.21 90 top
R8  100Ω  [R0603]  21.11 25.86 180 top
R9  22Ω  [R0805]  90.33 53.8 0 top
R10  22Ω  [R0805]  90.33 66.5 180 top
U1  NE555P  [DIP-8_L9.8-W6.6-P2.54-LS7.6-BL]  19.21 49.99 270 top
U2  CD74AC109E  [PDIP-16_L19.1-W6.4-P2.54-LS7.62-BL]  36.99 32.21 270 top
U3  SN74LS86N(XBLW)  [DIP-14_L19.0-W6.4-P2.54-LS7.6-BL]  36.99 53.8 270 top
U4  SN74LS04N  [PDIP-14_L19.7-W6.6-P2.54-LS8.3-BL]  58.58 59.96 0 top
U5  L293D  [DIP-16_L20.0-W6.4-P2.54-LS7.6-BL]  86.52 60.15 0 top
U8  -  [EdgeConnector-10P-2.54mm_]  25 0 0 top
U9  TP4056-42-ESOP8  [ESOP-8_L4.9-W3.9-P1.27-LS6.0-BL-EP]  20.48 18.24 0 top
U10  DW01A  [SOT-23-6_L2.9-W1.6-P0.95-LS2.8-BL]  19.21 32.21 180 top

## Footprints (pads in the part's own frame, mm; a bottom-side part is the same pattern mirrored in y, then rotated)
C0805
  rect 1.41x1.35 smd: 1(-1,0) 2(1,0)
CAP-TH_BD8.0-P3.50-D0.6-FD
  round 1.6 hole 1: 1(-1.75,0) 2(1.75,0)
CAP-TH_L5.5-W3.5-P5.00-D0.5
  round 1.4 hole 0.8: 1(-2.5,0) 2(2.5,0)
CONN-TH_B2B-PH-K-S
  round 1.6 hole 0.9: 1(1,0) 2(-1,0)
CONN-TH_B4B-PH-K-S
  round 1.6 hole 1: 1(3,0) 2(1,0) 3(-1,0) 4(-3,0)
DIP-8_L9.8-W6.6-P2.54-LS7.6-BL
  rect 1.5x1.5 hole 0.9: 1(-3.81,-3.81)
  round 1.5 hole 0.9: 2(-1.27,-3.81) 3(1.27,-3.81) 4(3.81,-3.81) 5(3.81,3.81) 6(1.27,3.81) 7(-1.27,3.81) 8(-3.81,3.81)
DIP-14_L19.0-W6.4-P2.54-LS7.6-BL
  rect 1.5x2 hole 1: 1(-7.62,-3.81)
  oval 1.5x2 hole 1: 2(-5.08,-3.81) 3(-2.54,-3.81) 4(0,-3.81) 5(2.54,-3.81) 6(5.08,-3.81) 7(7.62,-3.81) 8(7.62,3.81) 9(5.08,3.81) 10(2.54,3.81) 11(0,3.81) 12(-2.54,3.81) 13(-5.08,3.81) 14(-7.62,3.81)
DIP-16_L20.0-W6.4-P2.54-LS7.6-BL
  round 1.6 hole 1: 1(-8.89,-3.81) 2(-6.35,-3.81) 3(-3.81,-3.81) 4(-1.27,-3.81) 5(1.27,-3.81) 6(3.81,-3.81) 7(6.35,-3.81) 8(8.89,-3.81) 9(8.89,3.81) 10(6.35,3.81) 11(3.81,3.81) 12(1.27,3.81) 13(-1.27,3.81) 14(-3.81,3.81) 15(-6.35,3.81) 16(-8.89,3.81)
EdgeConnector-10P-2.54mm_
  rect 1.6x6.46 smd: 1(0,0) 2(2.54,0) 3(5.08,0) 4(7.62,0) 5(10.16,0)
  rect 1.6x6.46 smd far side: 6(10.16,0) 7(7.62,0) 8(5.08,0) 9(2.54,0) 10(0,0)
ESOP-8_L4.9-W3.9-P1.27-LS6.0-BL-EP
  rect 0.6x1.2 smd: 1(-1.905,-2.909) 2(-0.635,-2.909) 3(0.635,-2.909) 4(1.905,-2.909) 5(1.905,2.909) 6(0.635,2.909) 7(-0.635,2.909) 8(-1.905,2.909)
  rect 3.3x2.4 smd: 9(0,0)
LED0603-RD_BLUE
  rect 0.8x0.8 smd: 1(-0.799,-0.004) 2(0.799,0.004)
LED0603-RD_RED
  rect 0.8x0.8 smd: 1(-0.799,-0.004) 2(0.799,0.004)
LED-TH_4P-BD5.8-P1.30
  round 1 hole 0.7: 1(1.95,0) 2(0.65,0) 3(-0.65,0) 4(-1.95,0)
LED-TH_4P-BD5.8-P1.30#2
  round 1 hole 0.7: 1(1.95,0) 2(0.65,0) 3(-0.65,0) 4(-1.95,0)
Pad_e3190
  round 1.524 hole 0.914: 1(0,0)
Pad_e3447
  round 1.524 hole 0.914: 1(0,0)
Pad_e3454
  round 1.524 hole 0.914: 1(0,0)
PDIP-14_L19.7-W6.6-P2.54-LS8.3-BL
  rect 1.5x2 hole 1: 1(-7.62,-4)
  oval 1.5x2 hole 1: 2(-5.08,-4) 3(-2.54,-4) 4(0,-4) 5(2.54,-4) 6(5.08,-4) 7(7.62,-4) 8(7.62,4) 9(5.08,4) 10(2.54,4) 11(0,4) 12(-2.54,4) 13(-5.08,4) 14(-7.62,4)
PDIP-16_L19.1-W6.4-P2.54-LS7.62-BL
  rect 1.7x1.7 hole 1: 1(-8.89,-3.81)
  round 1.7 hole 1: 2(-6.35,-3.81) 3(-3.81,-3.81) 4(-1.27,-3.81) 5(1.27,-3.81) 6(3.81,-3.81) 7(6.35,-3.81) 8(8.89,-3.81) 9(8.89,3.81) 10(6.35,3.81) 11(3.81,3.81) 12(1.27,3.81) 13(-1.27,3.81) 14(-3.81,3.81) 15(-6.35,3.81) 16(-8.89,3.81)
R0603
  rect 0.806x0.864 smd: 1(-0.753,0) 2(0.753,0)
R0805
  rect 1.133x1.377 smd: 1(-1,0) 2(1,0)
RES-ADJ-TH_WH06-2C-103
  round 2 hole 1.3: 1(-2.5,-2.5) 2(2.5,-2.5) 3(0,2.5)
RES-TH_BD1.8-L3.2-P7.20-D0.4
  round 1.2 hole 0.8: 1(-3.6,0) 2(3.6,0)
SOT-23-6_L2.9-W1.6-P0.95-LS2.8-BL
  rect 0.532x1.072 smd: 1(-0.95,-1.149) 2(0,-1.149) 3(0.95,-1.149) 4(0.95,1.149) 5(0,1.149) 6(-0.95,1.149)
TSSOP-8_L4.4-W3.0-P0.65-LS6.4-BL
  oval 0.353x1.454 smd: 1(-0.975,-2.927) 2(-0.325,-2.927) 3(0.325,-2.927) 4(0.975,-2.927) 5(0.975,2.927) 6(0.325,2.927) 7(-0.325,2.927) 8(-0.975,2.927)

## Nets
As in the schematic.

Pads without a net: LED4 1; NOREF 1; NOREF#2 1; NOREF#3 1; R1 1; U1 5; U2 7 9; U3 6 8 11; U4 6 8 10 12; U8 3 4 7 8; U10 4

## Via types
v1: diameter 0.61, hole 0.305, Top Layer to Bottom Layer, 79 vias
v2: diameter 1.219, hole 0.61, Top Layer to Bottom Layer, 2 vias

## Routing (per net, layer and track width the routed paths; a pad name or vN(x,y) marks a point on that pad's centre or on a via; arc(x,y) is an arc through that point)
+5V: length 250.6
  Top Layer w0.762: U9.8 16.94,21.15 16.67,21.41 v2(16.03,21.41) ; C2.2 24.02,14.06 v2(23.66,14.43) 22.75,15.33 22.38,15.33 ; LED5.2 LED6.2 7.24,22.96 7.24,21.95 v1(7.78,21.41)
  Top Layer w1.016: U4.14 52.87,65.86 75.72,65.86 U5.16 73.82,63.96 C7.2 ; U2.1 U2.16
  Top Layer w1.27: 30.02,12.52 30.08,12.47 30.08,4.77 ; 30.02,12.52 30.02,14.6 C8.1 ; 30.02,12.52 C2.2
  Bottom Layer w0.762: U1.8 23.02,56.3 C6.2 ; U1.8 21.11,53.8 19.21,51.89 19.21,48.4 16.99,46.18 U1.4 ; U1.8 24.92,53.8 27,51.72 R3.2 33.18,41.42 U2.1 ; v2(23.66,14.43) 16.67,21.41 v2(16.03,21.41) v1(7.78,21.41)
  Bottom Layer w1.016: C4.2 43.34,53.76 43.34,43.64 U2.16 U2.15 U2.14 43.34,33.48 43.34,30.94 U2.11 ; U5.16 U5.1 80.81,53.16 93.5,53.16 95.41,55.07 U5.8 U5.9 ; 35.08,32.84 35.08,19.66 C8.1 30.08,14.66 30.08,4.77 ; 35.08,32.84 35.08,36.66 U2.2 U2.1 ; 35.08,32.84 U2.5 ; U4.14 45.88,58.88 45.88,56.34 U3.14
GND:
  vias: v1(8.41,30.62) v1(9.69,65.86) v1(10.52,61.32) v1(10.52,46.08) v1(10.52,15.6) v1(15.6,61.32) v1(15.6,56.24) v1(15.6,41) v1(15.6,15.6) v1(15.6,10.52) v1(16.03,24.27) v1(17.3,29.03) v1(17.62,49.99) v1(18.58,45.54) v1(19.21,65.86) v1(20.68,61.32) v1(20.68,56.24) v1(20.68,51.16) v1(21.43,23) v1(21.75,30.3) v1(25.76,61.32) v1(25.76,56.24) v1(25.76,51.16) v1(25.76,46.08) v1(25.76,35.92) v1(25.76,30.84) v1(25.76,25.76) v1(25.76,20.68) v1(25.76,15.6) v1(26.19,11.25) v1(30.84,61.32) v1(30.84,56.24) v1(30.84,51.16) v1(30.84,46.08) v1(30.84,41) v1(30.84,35.92) v1(30.84,30.84) v1(30.84,25.76) v1(35.92,61.32) v1(35.92,51.16) v1(35.92,46.08) v1(35.92,15.6) v1(36.04,56.34) v1(41,20.68) v1(41,15.6) v1(46.08,46.08) v1(46.08,25.76) v1(46.08,20.68) v1(46.08,15.6) v1(48.1,55.7) v1(51.16,61.32) v1(51.16,20.68) v1(51.16,15.6) v1(70.01,63.96) v1(75.09,56.34) v1(80.17,67.13) v1(81.64,51.16) v1(86.72,61.32) v1(86.72,51.16) v1(86.72,46.08) v1(86.72,41) v1(91.8,51.16) v1(91.8,46.08) v1(96.88,56.24) v1(96.88,51.16) v1(112.12,61.32) v1(112.12,56.24) v1(113.19,63.32) v1(117.2,61.32)
(no net): length 12.3
  Top Layer w1.016: 25,9.59 25,4.77 ; 27.54,9.59 27.54,4.77
  Bottom Layer w0.381: NOREF.1 117,55.74 LED4.1
A1: length 19.4
  Top Layer w0.762: CN3.1 CN2.1 97.14,53.8 R9.2
A2: length 20.2
  Top Layer w0.762: U5.6 93.14,59.15 CN2.2 CN3.2
B1: length 20.2
  Top Layer w0.762: CN3.3 CN2.3 93.14,61.15 U5.11
B2: length 19.4
  Top Layer w0.762: R10.1 97.14,66.5 CN2.4 CN3.4
BAT-: length 8.1
  Top Layer w0.508: Q2.2 Q2.3 13.8,36.34 13.5,36.66 7.88,36.66 CN1.1
BAT_VOUT: length 176.3
  Top Layer w0.381: LED1.2 4.65,63.91 5.88,62.69 v1(7.78,62.69) 13.5,62.69 14.65,63.84 ; 14.65,63.84 14.65,63.8 15.76,62.69 23.66,62.69 24.65,63.68 LED3.2 ; 14.65,63.84 LED2.2
  Top Layer w0.762: v1(10.32,28.4) 10.95,27.77 17.94,27.77 19.84,25.86 R8.2 20.36,25.34 22.38,23.32 22.38,21.15
  Bottom Layer w0.381: LED4.2 116.39,56.97 114.46,56.97 113.19,58.24 113.19,62.05 109.38,65.86 29.37,65.86 26.83,63.32 24.92,63.32 24.65,63.6 LED3.2
  Bottom Layer w0.762: v1(10.32,28.4) 10.32,37.29 9.05,38.56 CN1.2 v1(7.78,62.69)
CHARG: length 8.3
  Top Layer w0.508: U9.7 19.84,21.87 18.71,23 R5.1
DW01A-VCC: length 6.3
  Top Layer w0.508: R8.1 20.11,27.61 C1.2 19.21,29.3 U10.5
LED_DATA-0: length 79.2
  Top Layer w0.508: 22.46,4.77 v1(22.46,9.28)
  Bottom Layer w0.381: 22.46,4.77 v1(22.46,9.28) 21.75,9.98 19.84,9.98 15.4,14.43 7.78,14.43 6.51,15.7 6.51,60.78 5.24,62.05 3.33,62.05 2.05,63.34 LED1.4
PROG: length 3.9
  Top Layer w0.508: U9.2 19.84,13.04 R4.2
S-A1: length 90.6
  Top Layer w0.508: v1(79.53,61.42) 56.42,61.42 U4.1 49.31,57.61 36.04,57.61 34.77,58.88 U3.2
  Bottom Layer w0.508: U5.2 80.17,60.78 v1(79.53,61.42) ; U2.10 42.7,25.86 45.88,29.03 45.88,43 48.42,45.54 48.42,48.72 50.96,51.26 U4.1
S-A2: length 43.4
  Top Layer w0.508: v1(90.97,59.52) 90.33,60.15 57.69,60.15 U4.2
  Bottom Layer w0.508: U5.7 92.87,57.61 v1(90.97,59.52)
S-B1: length 65.5
  Top Layer w0.508: v1(88.43,58.88) 58.58,58.88 56.04,56.34 U4.3 53.88,53.8 45.25,53.8 43.97,55.07 36.04,55.07 34.77,56.34 U3.3
  Bottom Layer w0.508: U5.10 92.87,63.32 v1(88.43,58.88)
S-B2: length 33.6
  Top Layer w0.508: U4.4 60.23,57.61 69.38,57.61 71.91,55.07 80.81,55.07 81.44,55.7 v1(81.44,57.61)
  Bottom Layer w0.508: U5.15 81.44,62.69 v1(81.44,57.61)
STBY: length 10.9
  Top Layer w0.508: U9.6 21.11,22.05 17.16,26 R6.1
$1N1551: length 16.6
  Top Layer w0.508: U1.6 21.75,49.99 19.53,49.99 18.26,51.26 U1.2 ; R2.1 C5.2
  Bottom Layer w0.508: U1.2 14.77,51.89 C5.2
$1N1658: length 17.7
  Top Layer w0.508: R1.3 22.9,40.4 R3.1
  Bottom Layer w0.508: U1.7 24.92,49.35 24.92,42.42 R1.3
$1N1662: length 7.3
  Top Layer w0.508: R2.2 17.16,42.16 R1.2
$1N1856: length 29.3
  Top Layer w0.508: U1.3 17.94,48.72 19.84,46.81 19.84,37.92 23.02,34.75 26.83,34.75 28.1,33.48 U2.4
$1N1934: length 42.3
  Top Layer w0.508: U2.6 35.72,28.4 38.26,30.94 U2.12
  Bottom Layer w0.508: U3.1 38.26,56.34 38.26,33.48 U2.12
$1N10913: length 7.7
  Top Layer w0.762: R9.1 85.25,53.8 U5.3
$1N11045: length 7.7
  Top Layer w0.762: U5.14 85.25,66.5 R10.2
$2N372: length 7.6
  Top Layer w0.381: Q2.5 13.16,30.6 14.77,32.21 16.03,32.21 17.18,33.36 U10.3
$2N386: length 4.9
  Top Layer w0.381: R7.2 22.5,32.96 21.75,32.21 19.84,32.21 19.21,32.84 U10.2
$2N1182: length 6.1
  Top Layer w0.381: LED2.4 LED1.1
$2N1186: length 6.1
  Top Layer w0.381: LED3.4 LED2.1
$2N1199: length 95
  Bottom Layer w0.381: LED3.1 26.26,64.34 28.36,66.45 111.34,66.45 114.95,62.83 LED4.4
$2N2605: length 2.4
  Top Layer w0.508: R6.2 8.8,26 LED5.1
$2N2609: length 2.4
  Top Layer w0.508: LED6.1 11.24,23 R5.2
$2N3306: length 6.9
  Top Layer w0.381: Q2.8 16.03,30.21 v1(16.03,30.3) ; v1(16.03,34.75) 15.49,34.75 Q2.1
  Bottom Layer w0.381: v1(16.03,30.3) v1(16.03,34.75)
$2N3476: length 9.8
  Top Layer w0.381: Q2.4 13.16,33.82 13.5,33.48 16.03,33.48 17.3,34.75 19.21,34.75 20.16,33.8 U10.1

## Copper pours and planes (outline as drawn; the poured copper is in the pictures)
GND on Top Layer: -5,71 130,71 130,-3 -5,-3
GND on Bottom Layer: -5,71 130,71 130,-3 -5,-3

## Text on the board
Bottom Silkscreen Layer: 5V NC NC LED GND | VOTV_Drive / V1.0
Document Layer: Board Origin
Top Silkscreen Layer: B2 / B1 / A2 / A1 | Charged | Charging | BATT | - | + | NE555P | SN74LS86N / XOR | CD74AC109E / JK-FF | SN74LS04N / HEX Inverter | L293D / Motor driver
